# EAGLE schematic RAUPS_SingleLayer_Stepper (EAGLE 7.2.0)
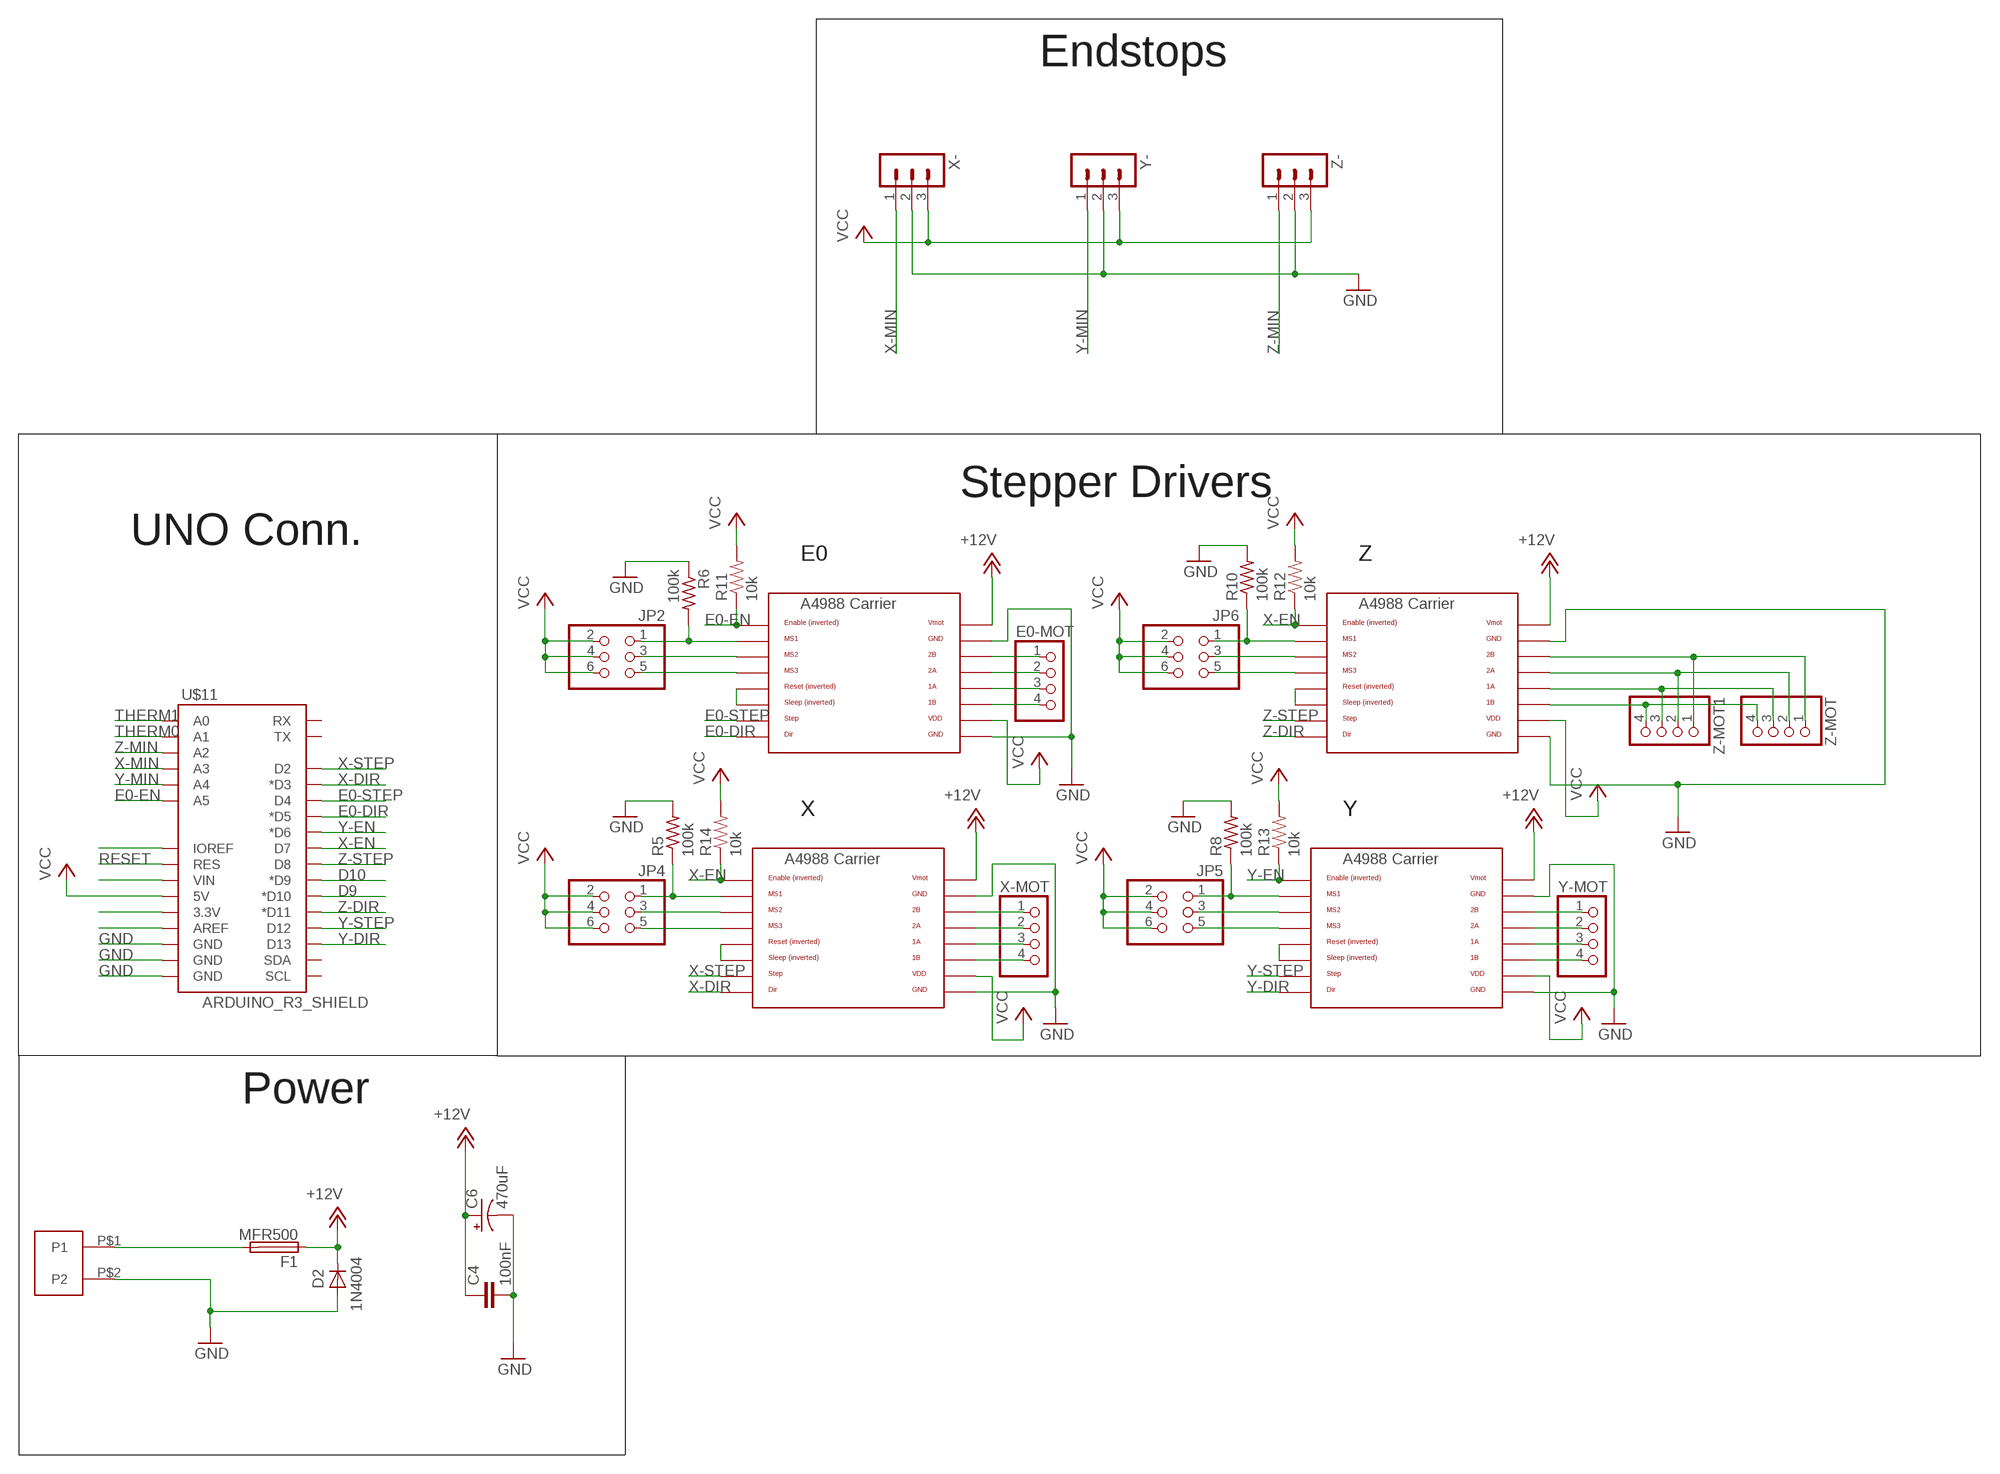
[diagram p0: schematic, sheet 1]

## Parts
C4  100nF  C2,5-3  [C2.5-3]
C6  470uF  CPOL-USE3.5-8  [E3,5-8]
D2  1N4004  [DO41-10]
E0-MOT  PINHD-1X4  [1X04]
F1  MFR500  PTCFUSE  [MFR500]
JP2  PINHD-2X3  [2X03]
JP4  PINHD-2X3  [2X03]
JP5  PINHD-2X3  [2X03]
JP6  PINHD-2X3  [2X03]
R5  100k  R-US_0207/7  [0207/7]
R6  100k  R-US_0207/7  [0207/7]
R8  100k  R-US_0207/7  [0207/7]
R10  100k  R-US_0207/7  [0207/7]
R11  10k  10KOHM-1/4W-1%(PTH)HORIZ  [AXIAL-0.3]
R12  10k  10KOHM-1/4W-1%(PTH)HORIZ  [AXIAL-0.3]
R13  10k  10KOHM-1/4W-1%(PTH)HORIZ  [AXIAL-0.3]
R14  10k  10KOHM-1/4W-1%(PTH)HORIZ  [AXIAL-0.3]
U$1  2PIN_SOCKET  [CONN-2PIN]
U$4  A4988BREAKOUT  [A4988BREAKOUT]
U$6  A4988BREAKOUT  [A4988BREAKOUT]
U$7  A4988BREAKOUT  [A4988BREAKOUT]
U$8  A4988BREAKOUT  [A4988BREAKOUT]
U$11  ARDUINO_R3_SHIELD  [UNO_R3_SHIELD]
X-  3PIN-HEADER  [3PIN-HEADER]
X-MOT  PINHD-1X4  [1X04]
Y-  3PIN-HEADER  [3PIN-HEADER]
Y-MOT  PINHD-1X4  [1X04]
Z-  3PIN-HEADER  [3PIN-HEADER]
Z-MOT  PINHD-1X4  [1X04]
Z-MOT1  PINHD-1X4  [1X04]

## Nets
+12V: C4.1 C6.+ D2.C F1.1 U$4.VMOT U$6.VMOT U$7.VMOT U$8.VMOT
D9: U$11.D10(*D10)
D10: U$11.D9(*D9)
E0-DIR: U$4.DIR U$11.D5(*D5)
E0-EN: R11.P$1 U$4.EN U$11.A5
E0-STEP: U$4.STEP U$11.D4
GND: C4.2 C6.- D2.A R5.2 R6.1 R8.2 R10.2 U$1.P$2(P2) U$4.GND U$4.GND@0(GND) U$6.GND U$6.GND@0(GND) U$7.GND U$7.GND@0(GND) U$8.GND U$8.GND@0(GND) U$11.GND@0(GND) U$11.GND@1(GND) U$11.GND@2(GND) X-.2 Y-.2 Z-.2
N$3: E0-MOT.1 U$4.2B
N$4: E0-MOT.2 U$4.2A
N$5: JP2.1 R6.2 U$4.MS1
N$6: JP2.5 U$4.MS3
N$8: U$4.RST U$4.SLP(SLEEP)
N$9: JP2.3 U$4.MS2
N$10: E0-MOT.3 U$4.1A
N$11: E0-MOT.4 U$4.1B
N$12: U$11.IOREF
N$14: JP4.1 R5.1 U$6.MS1
N$15: JP4.3 U$6.MS2
N$16: U$11.VIN
N$17: JP5.3 U$7.MS2
N$19: JP4.5 U$6.MS3
N$20: U$6.RST U$6.SLP(SLEEP)
N$21: U$6.2B X-MOT.1
N$22: U$6.2A X-MOT.2
N$23: U$7.RST U$7.SLP(SLEEP)
N$24: U$11.3.3V
N$25: U$11.AREF
N$26: U$6.1A X-MOT.3
N$27: U$6.1B X-MOT.4
N$28: U$7.2B Y-MOT.1
N$29: U$7.2A Y-MOT.2
N$30: U$7.1A Y-MOT.3
N$31: JP5.5 U$7.MS3
N$32: F1.2 U$1.P$1(P1)
N$33: JP5.1 R8.1 U$7.MS1
N$36: U$7.1B Y-MOT.4
N$37: JP6.3 U$8.MS2
N$38: U$8.RST U$8.SLP(SLEEP)
N$39: JP6.5 U$8.MS3
N$40: JP6.1 R10.1 U$8.MS1
N$41: U$8.2B Z-MOT1.1 Z-MOT.1
N$42: U$8.2A Z-MOT1.2 Z-MOT.2
N$43: U$8.1A Z-MOT1.3 Z-MOT.3
N$44: U$8.1B Z-MOT1.4 Z-MOT.4
RESET: U$11.RES
THERM0: U$11.A1
THERM1: U$11.A0
VCC: JP2.2 JP2.4 JP2.6 JP4.2 JP4.4 JP4.6 JP5.2 JP5.4 JP5.6 JP6.2 JP6.4 JP6.6 R11.P$2 R12.P$2 R13.P$2 R14.P$2 U$4.VDD U$6.VDD U$7.VDD U$8.VDD U$11.5V X-.3 Y-.3 Z-.3
X-DIR: U$6.DIR U$11.D3(*D3)
X-EN: R12.P$1 R14.P$1 U$6.EN U$8.EN U$11.D7
X-MIN: U$11.A3 X-.1
X-STEP: U$6.STEP U$11.D2
Y-DIR: U$7.DIR U$11.D13
Y-EN: R13.P$1 U$7.EN U$11.D6(*D6)
Y-MIN: U$11.A4 Y-.1
Y-STEP: U$7.STEP U$11.D12
Z-DIR: U$8.DIR U$11.D11(*D11)
Z-MIN: U$11.A2 Z-.1
Z-STEP: U$8.STEP U$11.D8
Unconnected: U$11.RX U$11.SCL U$11.SDA U$11.TX

## Notes on the sheet
- Endstops
- Stepper Drivers
- UNO Conn.
- E0 | Z
- X | Y
- Power

## Library data of the parts
C4 = capacitor-wima:C: CAPACITOR naming: grid - package width
C6 = adafruit:CPOL-US: POLARIZED CAPACITOR, American symbol
D2 = diode:1N4004: DIODE general purpose rectifier, 1 A
E0-MOT X-MOT Y-MOT Z-MOT Z-MOT1 = RepRapjr:PINHD-1X4: PIN HEADER
F1 = RepRapjr:PTCFUSE: LITTLEFUSE Picofuse/slow Littlefuse
JP2 JP4-JP6 = pinhead:PINHD-2X3: PIN HEADER
R5 R6 R8 R10 = adafruit:R-US_: RESISTOR, American symbol
R11-R14 = SparkFun-Resistors:10KOHM-1/4W-1%(PTH): RES-12183; PROD_ID: RES-12183
U$1 = ControllerCard:2PIN_SOCKET
U$4 U$6-U$8 = RepRapjr:A4988BREAKOUT
U$11 = SparkFun-Boards:ARDUINO_R3_SHIELD: Shield form compatible with the Arduino Uno R3.
X- Y- Z- = ultimachine:3PIN-HEADER: PIN HEADER

## Net classes
0 default: width 0.406 mm